# Altium schematic sheet Connectors.SchDoc
size A4; SheetNumber: 1; SheetTotal: 1
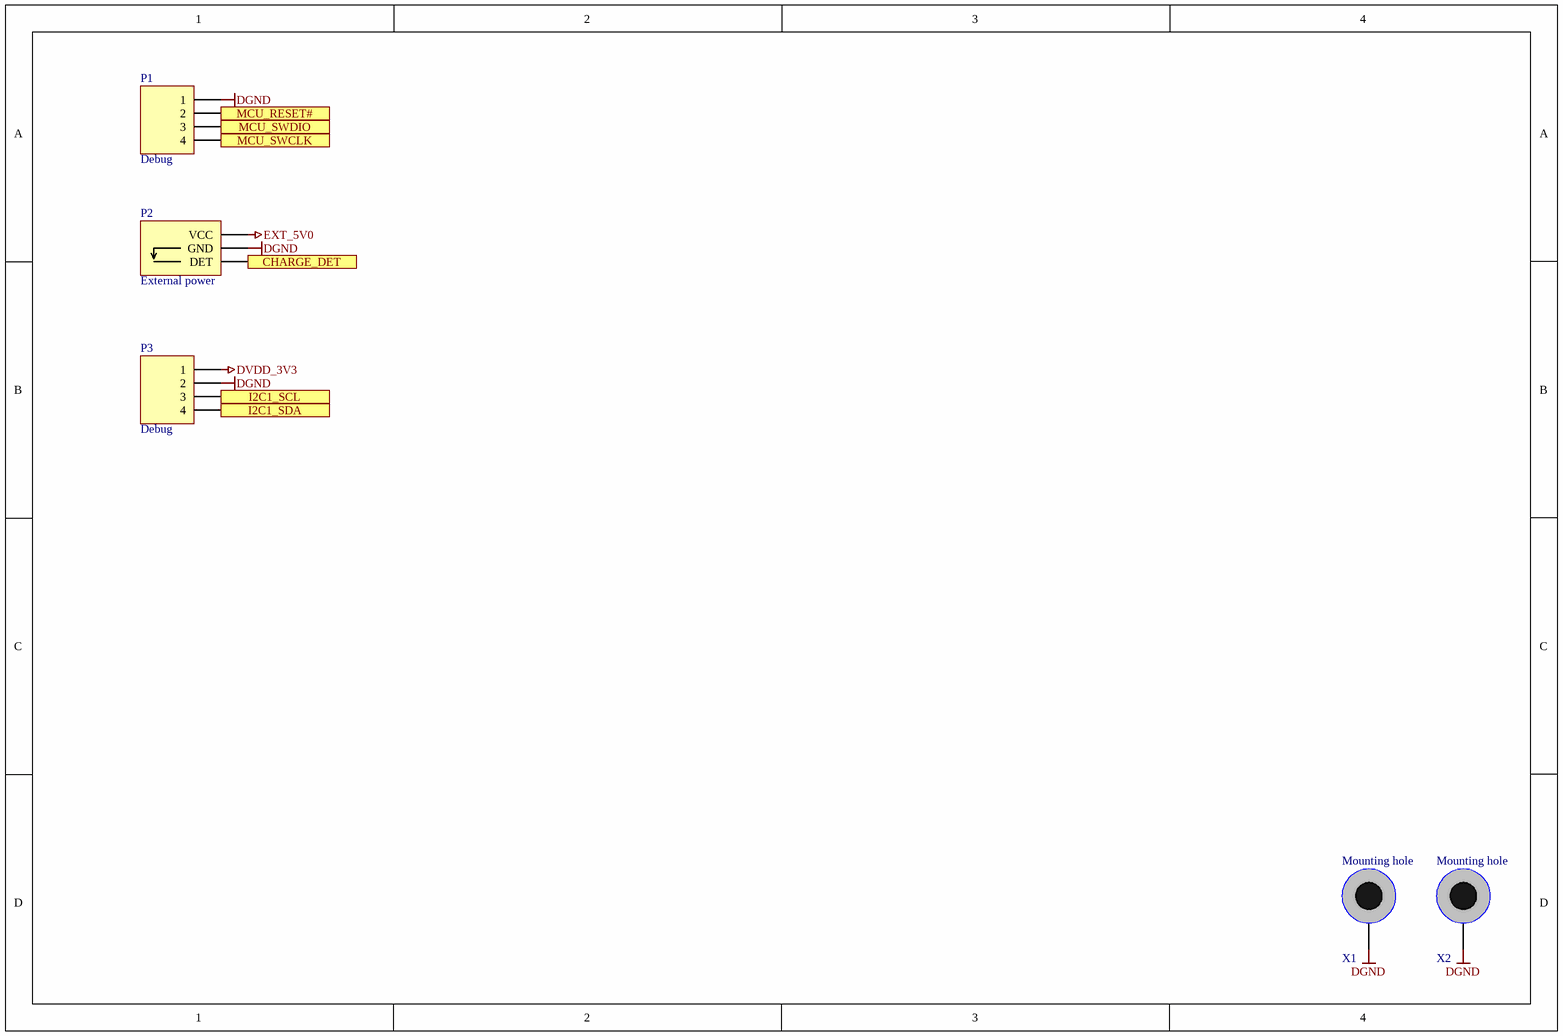
[diagram p0: Connectors.SchDoc]

## Parts
P1  Debug  [PLS-4 2.54]
P2  External power  [DC-210]
P3  Debug  [PLS-4 2.54]
X1  Mounting hole  [HOLE_M2_D4.0/2.5]  (no BOM)
X2  Mounting hole  [HOLE_M2_D4.0/2.5]  (no BOM)

## Ports
CHARGE_DET, I2C1_SCL, I2C1_SDA, MCU_RESET#, MCU_SWCLK, MCU_SWDIO

## Nets
DGND: P1.1 P2.2(GND) P3.2 X1.1 X2.1
DVDD_3V3: P3.1
EXT_5V0: P2.1(VCC)
CHARGE_DET: P2.3(DET) ; port CHARGE_DET
I2C1_SCL: P3.3 ; port I2C1_SCL
I2C1_SDA: P3.4 ; port I2C1_SDA
MCU_RESET#: P1.2 ; port MCU_RESET#
MCU_SWCLK: P1.4 ; port MCU_SWCLK
MCU_SWDIO: P1.3 ; port MCU_SWDIO

## Library data of the parts
P1 P3 = Header 4: Header, 4-Pin; LatestRevisionDate: 17-Jul-2002; LatestRevisionNote: Re-released for DXP Platform.; Publisher: Altium Limited
P2 = DC-210: Power connector 3.5mm; LatestRevisionDate: 17-Jul-2002; LatestRevisionNote: Re-released for DXP Platform.; Publisher: Altium Limited
X1 X2 = Mounting hole: Hole for screw M3, outline D6